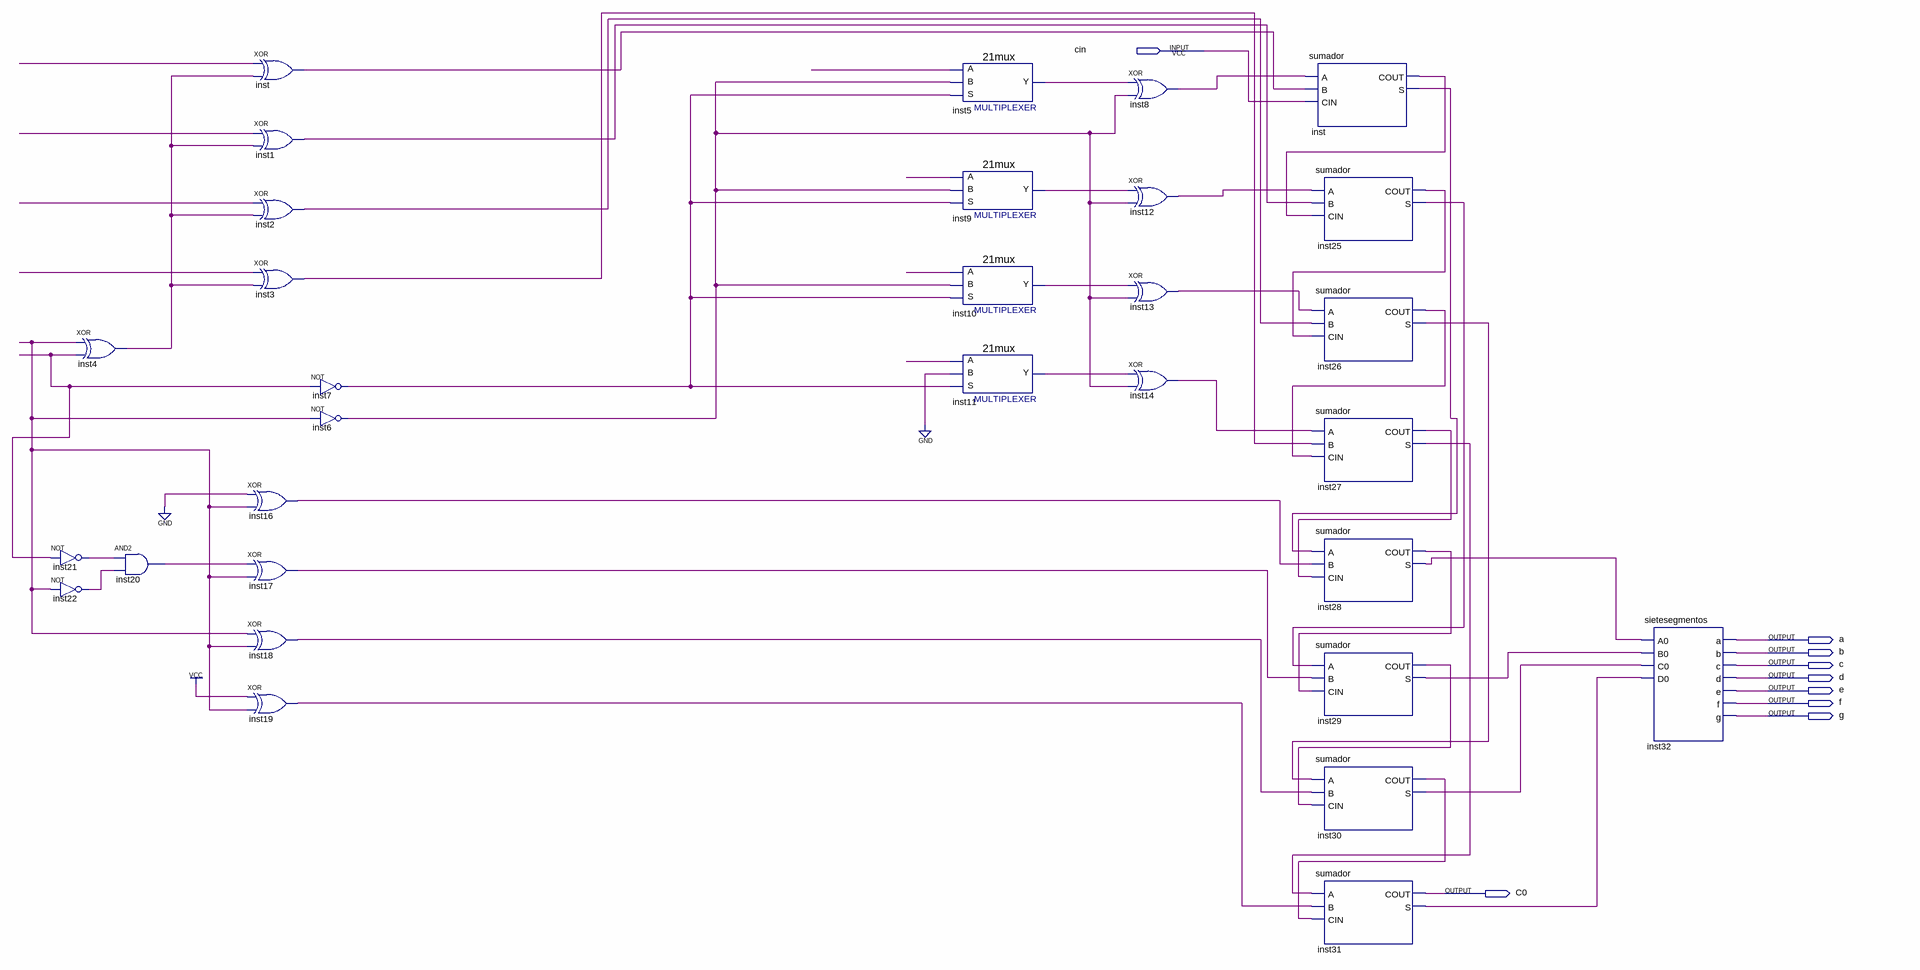
[diagram p0: schematic sheet]
// Quartus schematic parcial_digitales2.bdf as structural Verilog: 31 symbols, 9 pins
module parcial_digitales2 (
  input  cin,
  output a,
  output b,
  output c,
  output d,
  output e,
  output f,
  output g,
  output C0
);

  wire inst1_out, inst2_out, inst3_out, inst4_out, inst5_y, inst6_out, inst7_out, inst8_out, inst9_y,
       inst10_y, inst11_y, inst12_out, inst13_out, inst14_out, inst16_out, inst17_out, inst18_out,
       inst19_out, inst20_out, inst21_out, inst22_out, inst25_cout, inst25_s, inst26_cout, inst26_s,
       inst27_cout, inst27_s, inst28_cout, inst28_s, inst29_cout, inst29_s, inst30_cout, inst30_s, inst31_s,
       inst_cout, inst_out, inst_s, undriven, undriven_2, undriven_3, undriven_4, undriven_5, undriven_6,
       undriven_7, undriven_8, undriven_9, undriven_10;

  xor inst4 (inst4_out, undriven_10, undriven_9);
  not inst21 (inst21_out, undriven_9);
  not inst22 (inst22_out, undriven_10);
  and inst20 (inst20_out, inst21_out, inst22_out);
  xor inst (inst_out, undriven_5, inst4_out);
  xor inst1 (inst1_out, undriven_6, inst4_out);
  xor inst2 (inst2_out, undriven_7, inst4_out);
  xor inst3 (inst3_out, undriven_8, inst4_out);
  xor inst16 (inst16_out, 1'b0, undriven_10);
  xor inst17 (inst17_out, inst20_out, undriven_10);
  xor inst18 (inst18_out, undriven_10, undriven_10);
  xor inst19 (inst19_out, 1'b1, undriven_10);
  not inst7 (inst7_out, undriven_9);
  not inst6 (inst6_out, undriven_10);
  \21mux  inst5 (.S(inst7_out), .B(inst6_out), .A(undriven), .Y(inst5_y));
  \21mux  inst9 (.S(inst7_out), .B(inst6_out), .A(undriven_2), .Y(inst9_y));
  \21mux  inst10 (.S(inst7_out), .B(inst6_out), .A(undriven_3), .Y(inst10_y));
  \21mux  inst11 (.S(inst7_out), .B(1'b0), .A(undriven_4), .Y(inst11_y));
  xor inst8 (inst8_out, inst5_y, inst6_out);
  xor inst12 (inst12_out, inst9_y, inst6_out);
  xor inst13 (inst13_out, inst10_y, inst6_out);
  xor inst14 (inst14_out, inst11_y, inst6_out);
  sumador inst_dup2 (.A(inst8_out), .B(inst_out), .CIN(cin), .COUT(inst_cout), .S(inst_s));
  sumador inst25 (.A(inst12_out), .B(inst1_out), .CIN(inst_cout), .COUT(inst25_cout), .S(inst25_s));
  sumador inst26 (.A(inst13_out), .B(inst2_out), .CIN(inst25_cout), .COUT(inst26_cout), .S(inst26_s));
  sumador inst27 (.A(inst14_out), .B(inst3_out), .CIN(inst26_cout), .COUT(inst27_cout), .S(inst27_s));
  sumador inst28 (.A(inst_s), .B(inst16_out), .CIN(inst27_cout), .COUT(inst28_cout), .S(inst28_s));
  sumador inst29 (.A(inst25_s), .B(inst17_out), .CIN(inst28_cout), .COUT(inst29_cout), .S(inst29_s));
  sumador inst30 (.A(inst26_s), .B(inst18_out), .CIN(inst29_cout), .COUT(inst30_cout), .S(inst30_s));
  sumador inst31 (.A(inst27_s), .B(inst19_out), .CIN(inst30_cout), .COUT(C0), .S(inst31_s));
  sietesegmentos inst32 (
    .A0(inst28_s), .B0(inst29_s), .C0(inst30_s), .D0(inst31_s), .a(a), .b(b), .c(c), .d(d), .e(e), .f(f),
    .g(g));
endmodule
